# EAGLE schematic MainBoard (EAGLE 9.6.2)
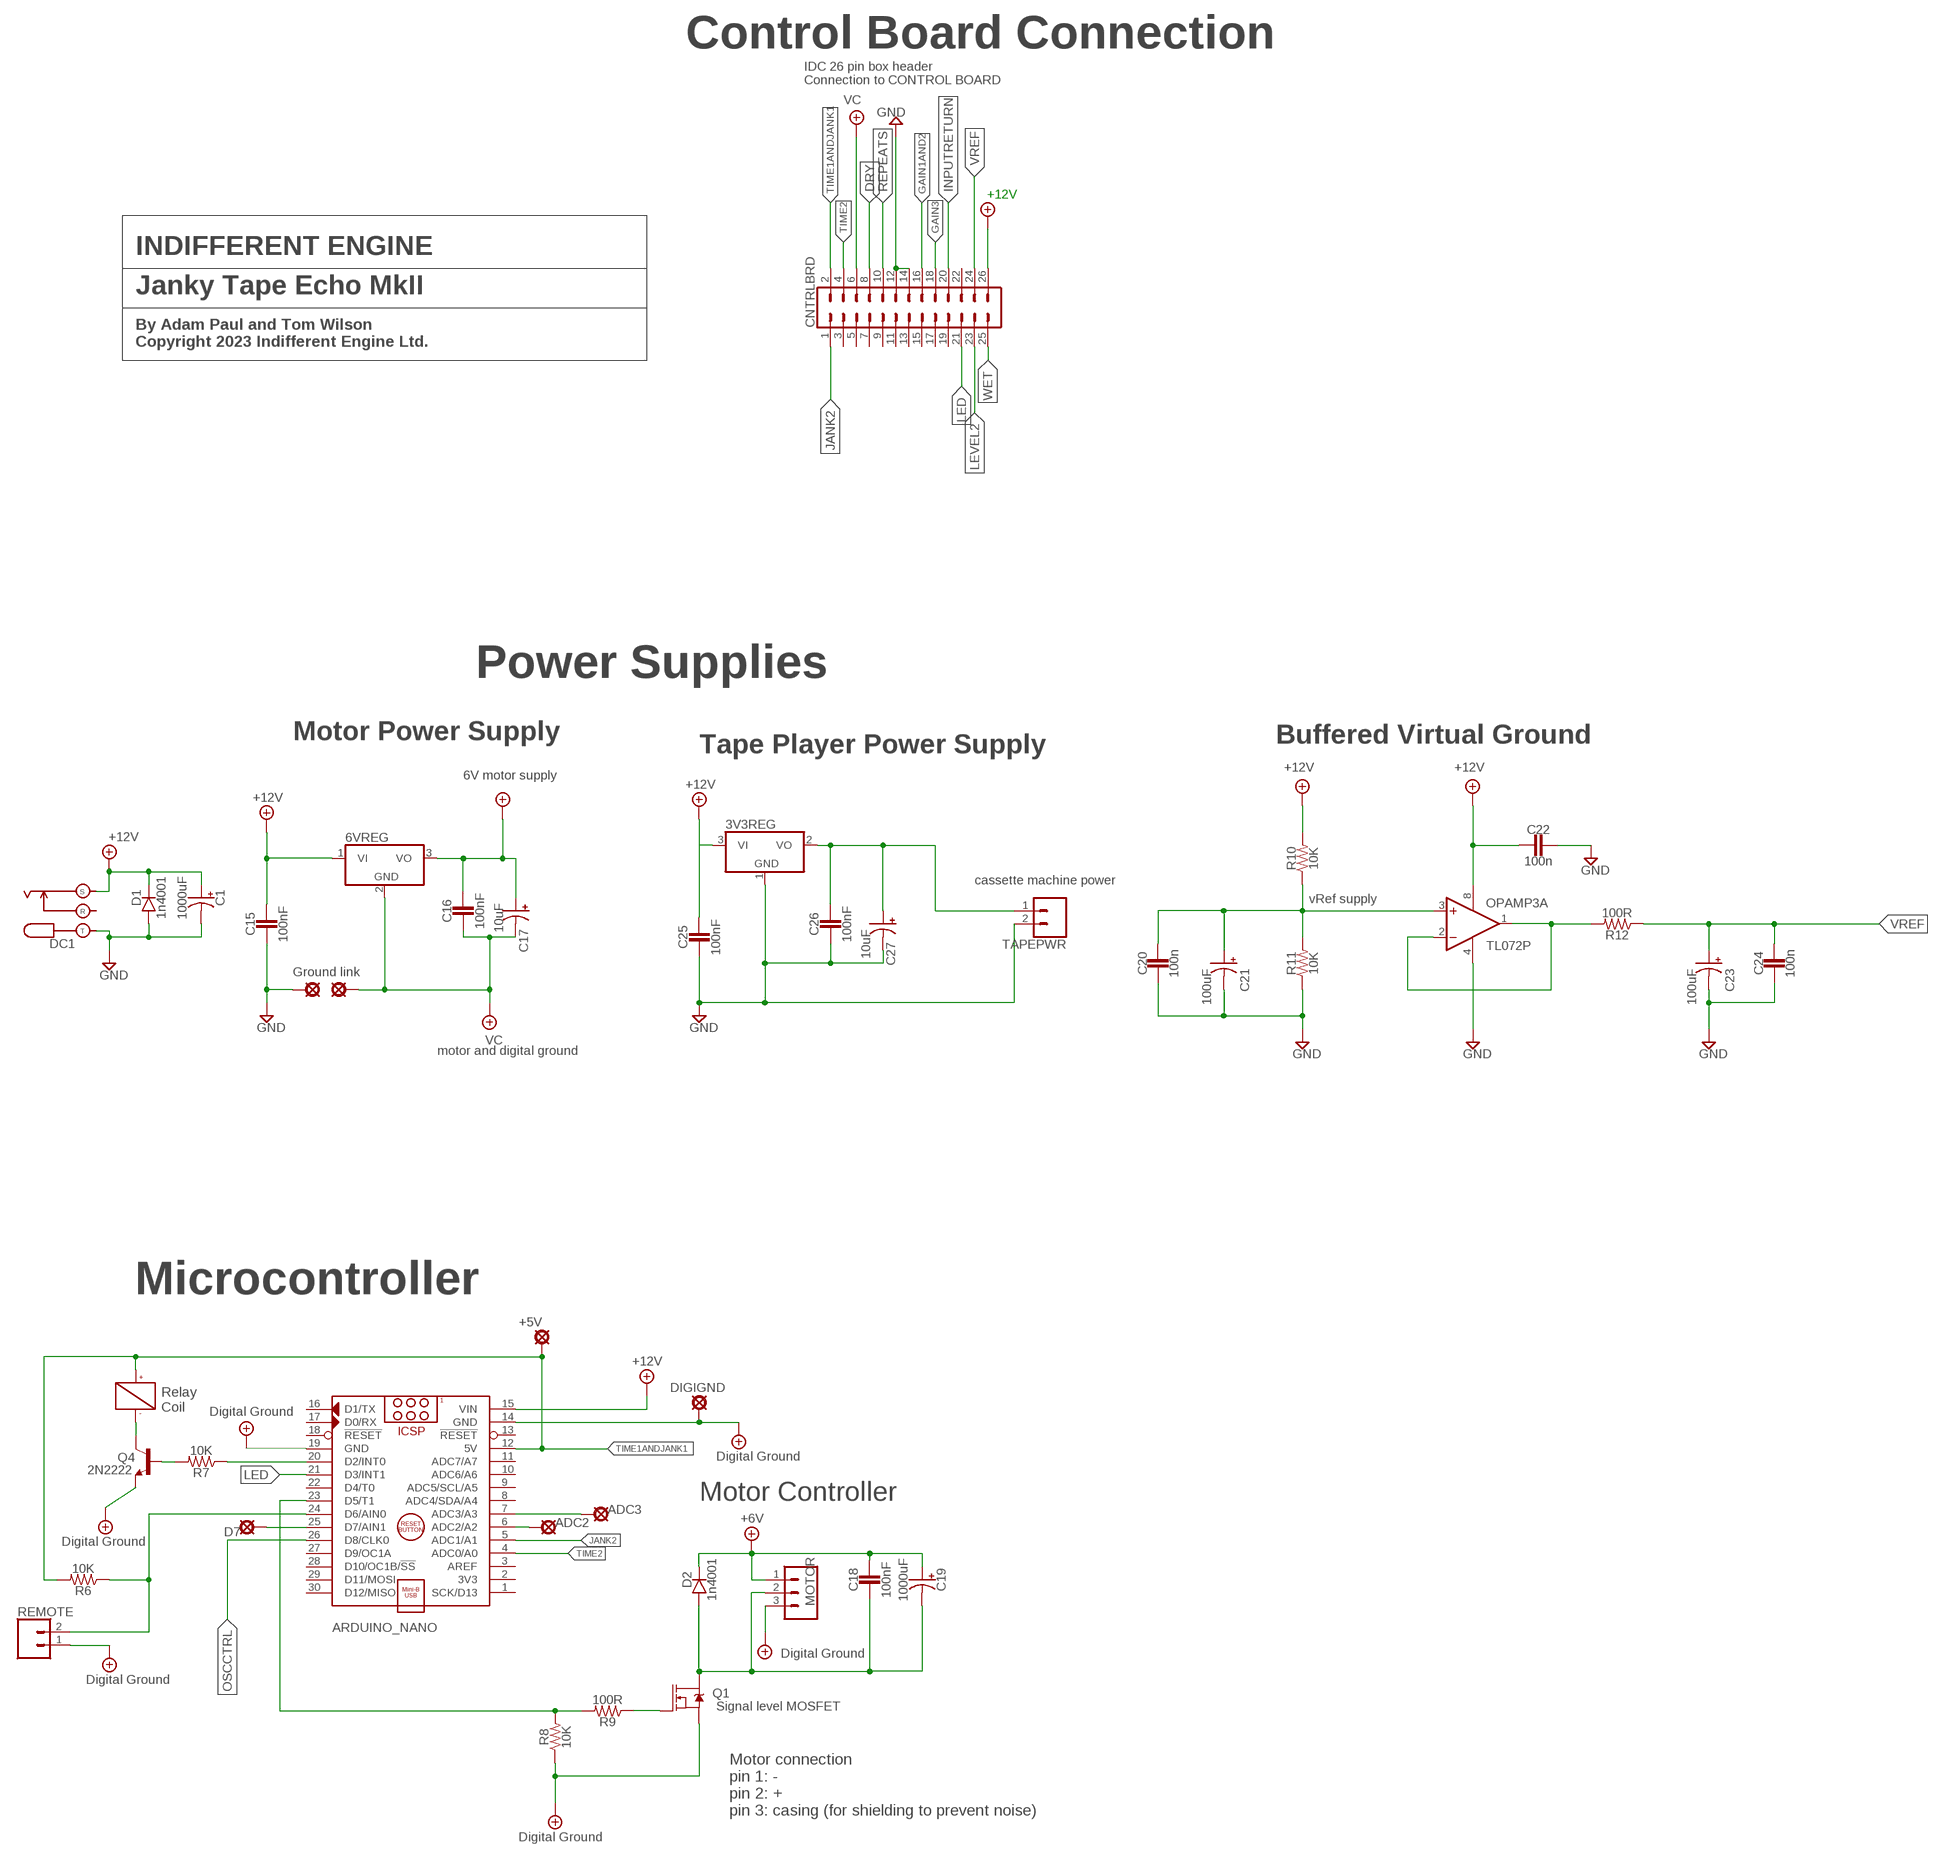
[diagram p0: schematic, sheet 1, part 1 of 2]
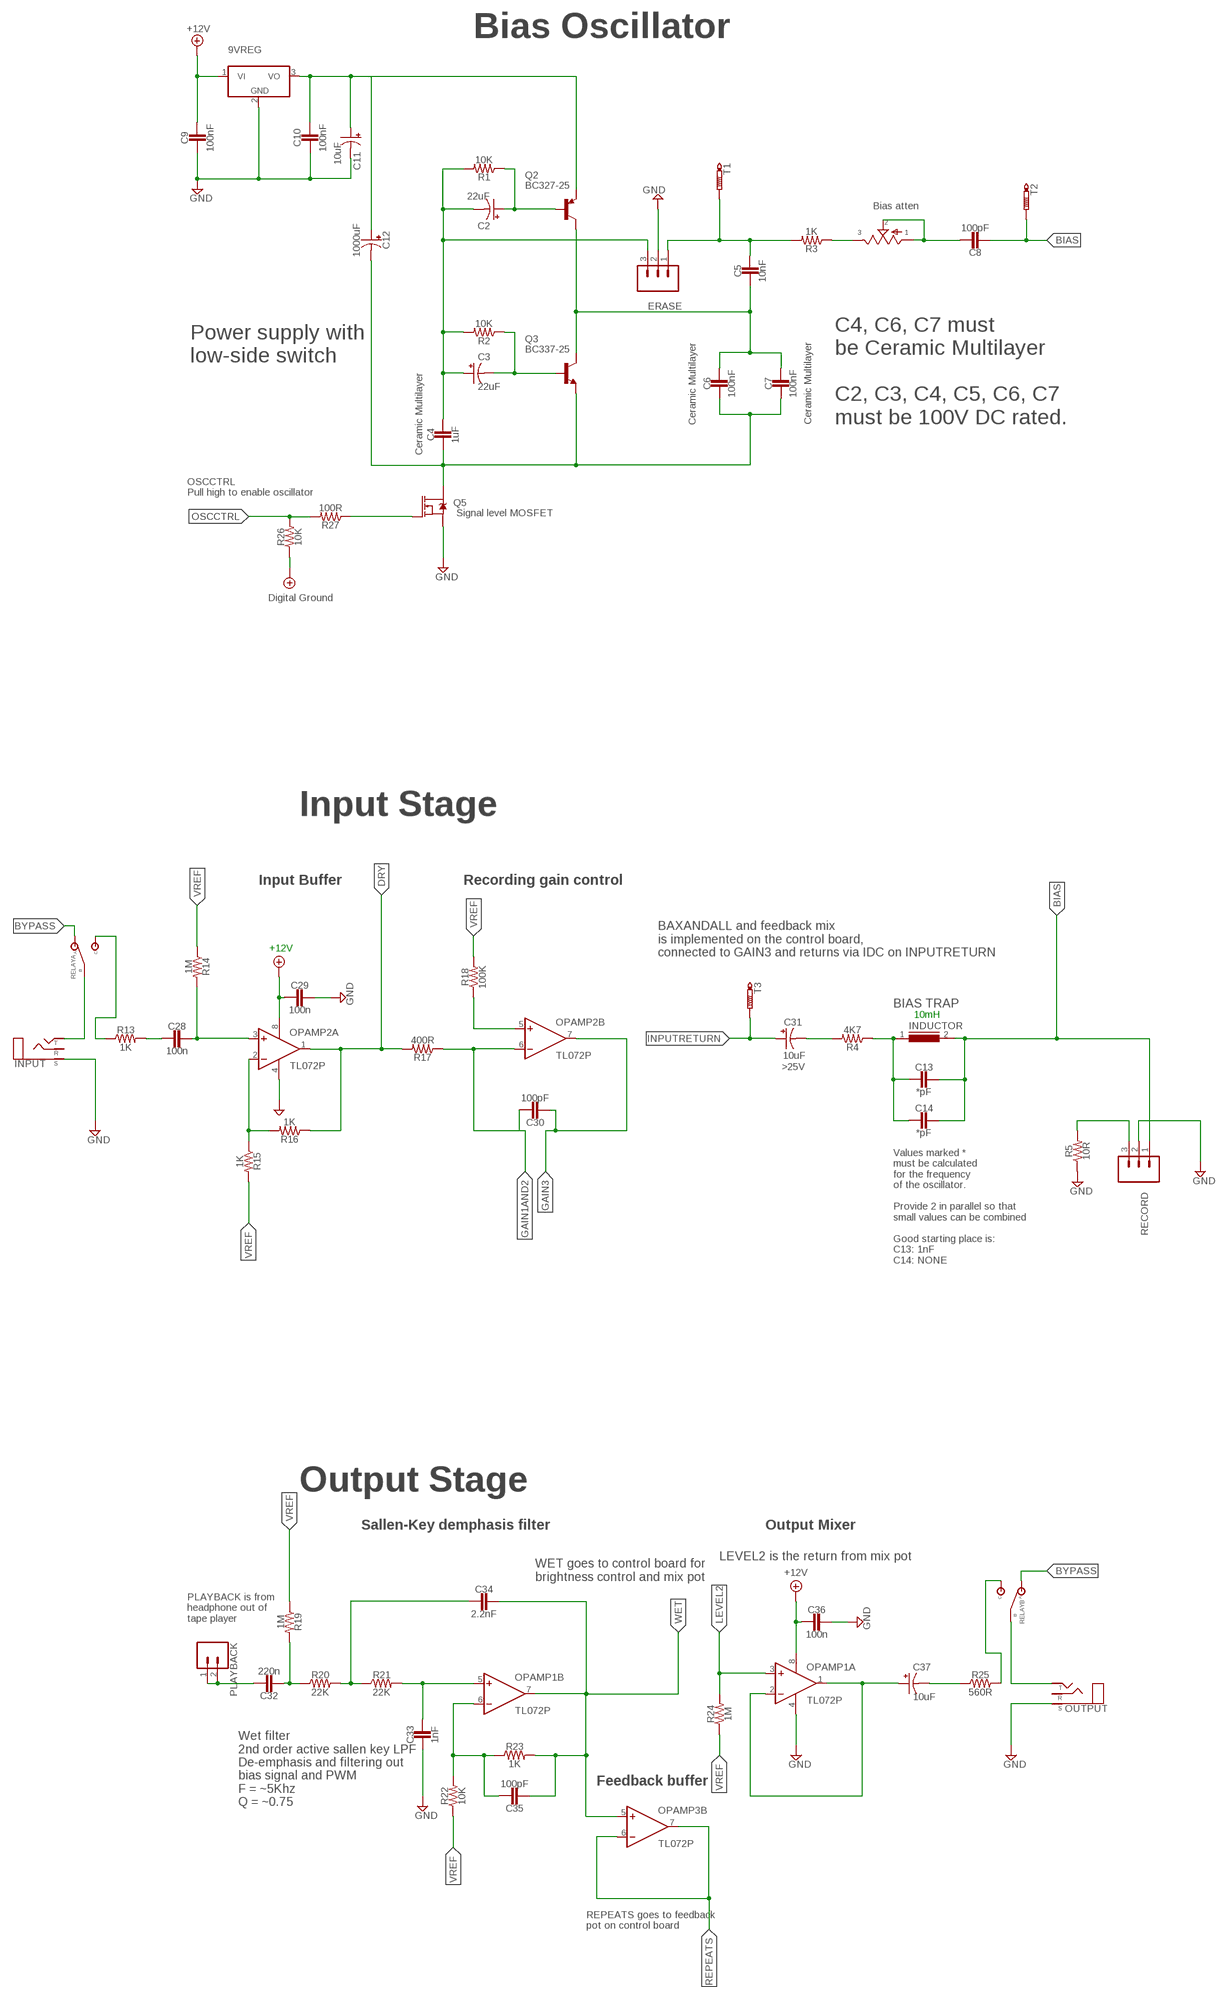
[diagram p1: schematic, sheet 1, part 2 of 2]

## Parts
3V3REG  78TO220H_2_SMALL  [TO220H_SMALL]
6VREG  78TO220H_SMALL  [TO220H_SMALL]
9VREG  78TO220H_SMALL  [TO220H_SMALL]
+5V  PADL  [LONG]
ADC2  PADL  [LONG]
ADC3  PADL  [LONG]
ANALOG_GND  PADL  [LONG]
ARDUINO_NANO  ARDUINO_NANO  [ARDUINO_NANO]
BIASLEVEL  POTTRIM3/8  [B375P]
C1  1000uF  8.0_MM.2  [080_5MM]
C2  22uF  5.0_MM.3  [050_2.5MM.1]
C3  22uF  5.0_MM.3  [050_2.5MM.1]
C4  1uF  CAP.2  [5MM]
C5  10nF  CAP.2  [5MM]
C6  100nF  CAP.2  [5MM]
C7  100nF  CAP.2  [5MM]
C8  100pF  CAP.5  [.33UF+]
C9  100nF  CAP.2  [5MM]
C10  100nF  CAP.2  [5MM]
C11  10uF  5.0_MM.3  [050_2.5MM.1]
C12  1000uF  8.0_MM.2  [080_5MM]
C13  *pF  CAP.5  [.33UF+]
C14  *pF  CAP.5  [.33UF+]
C15  100nF  CAP.2  [5MM]
C16  100nF  CAP.2  [5MM]
C17  10uF  5.0_MM.3  [050_2.5MM.1]
C18  100nF  CAP.5  [.33UF+]
C19  1000uF  8.0_MM.2  [080_5MM]
C20  100n  CAP.2  [5MM]
C21  100uF  5.0_MM.3  [050_2.5MM.1]
C22  100n  CAP.2  [5MM]
C23  100uF  5.0_MM.3  [050_2.5MM.1]
C24  100n  CAP.2  [5MM]
C25  100nF  CAP.2  [5MM]
C26  100nF  CAP.2  [5MM]
C27  10uF  5.0_MM.3  [050_2.5MM.1]
C28  100n  CAP.5  [.33UF+]
C29  100n  CAP.2  [5MM]
C30  100pF  CAP.5  [.33UF+]
C31  10uF  5.0_MM.3  [050_2.5MM.1]
C32  220n  CAP.5  [.33UF+]
C33  1nF  CAP.5  [.33UF+]
C34  2.2nF  CAP.5  [.33UF+]
C35  100pF  CAP.5  [.33UF+]
C36  100n  CAP.2  [5MM]
C37  10uF  5.0_MM.3  [050_2.5MM.1]
CNTRLBRD  CONN_13X22X13  [2X13]
D1  1n4001  DO41.3  [DO41-3]
D2  1n4001  DO41.3  [DO41-3]
D7  PADL  [LONG]
DC1  DC_KOBICONN  [DC_KOBICONN]
DIGI_GROUND  PADL  [LONG]
DIGIGND  PADL  [LONG]
ERASE  455-1750-1-ND  CONN_03  [1X03]
INDUCTOR  82114R  [82114R]
INPUT  STEREO  [STEREO_PCB]
MOTOR  455-1750-1-ND  CONN_03  [1X03]
OPAMP1  TL072P  [DIL08]
OPAMP2  TL072P  [DIL08]
OPAMP3  TL072P  [DIL08]
OUTPUT  STEREO  [STEREO_PCB]
PLAYBACK  CONN_02  [1X02]
Q1  60V/32A/35mΩ  MOSFET-NCH-FQP30N06L  [TO220V]
Q2  BC327-25  [TO92-EBC]
Q3  BC337-25TO92  [TO92-EBC]
Q4  2N2222  [TO92-]
Q5  60V/32A/35mΩ  MOSFET-NCH-FQP30N06L  [TO220V]
R1  10K  R.3B  [7.5MM.2]
R2  10K  R.3B  [7.5MM.2]
R3  1K  R.3B  [7.5MM.2]
R4  4K7  R.3B  [7.5MM.2]
R5  10R  R.3B  [7.5MM.2]
R6  10K  R.3B  [7.5MM.2]
R7  10K  R.3B  [7.5MM.2]
R8  10K  R.3B  [7.5MM.2]
R9  100R  R.3B  [7.5MM.2]
R10  10K  R.3B  [7.5MM.2]
R11  10K  R.3B  [7.5MM.2]
R12  100R  R.3B  [7.5MM.2]
R13  1K  R.3B  [7.5MM.2]
R14  1M  R.3B  [7.5MM.2]
R15  1K  R.3B  [7.5MM.2]
R16  1K  R.3B  [7.5MM.2]
R17  400R  R.3B  [7.5MM.2]
R18  100K  R.3B  [7.5MM.2]
R19  1M  R.3B  [7.5MM.2]
R20  22K  R.3B  [7.5MM.2]
R21  22K  R.3B  [7.5MM.2]
R22  10K  R.3B  [7.5MM.2]
R23  1K  R.3B  [7.5MM.2]
R24  1M  R.3B  [7.5MM.2]
R25  560R  R.3B  [7.5MM.2]
R26  10K  R.3B  [7.5MM.2]
R27  100R  R.3B  [7.5MM.2]
RECORD  455-1750-1-ND  CONN_03  [1X03]
RELAY  IM02TSIM02TS  [8-PIN]
REMOTE  CONN_02  [1X02]
T1  PTR1B2,54  [B2,54]
T2  PTR1B2,54  [B2,54]
T3  PTR1B2,54  [B2,54]
TAPEPWR  CONN_02  [1X02]

## Nets
+12V: 3V3REG.3(VI) 6VREG.1(VI) 9VREG.1(VI) ARDUINO_NANO.15(VIN) C1.+ C9.1 C15.1 C22.2 C25.1 C29.2 C36.2 CNTRLBRD.26 D1.C DC1.S OPAMP1.8(P:V+) OPAMP2.8(P:V+) OPAMP3.8(P:V+) R10.2 ; supply symbol labelled +9V
BIAS: C8.2 C13.1 C14.1 INDUCTOR.2 RECORD.1 T2.TP
BYPASS: RELAY.3(A:A) RELAY.10(B:A)
DRY: CNTRLBRD.8 OPAMP2.1(A:OUT) R16.1 R17.2
GAIN1AND2: C30.1 CNTRLBRD.16 OPAMP2.6(B:-IN) R17.1
GAIN3: C30.2 CNTRLBRD.18 OPAMP2.7(B:OUT)
GND: 3V3REG.1(GND) 9VREG.2(GND) ANALOG_GND.1(PAD) C1.- C9.2 C10.2 C11.- C15.2 C20.2 C21.- C22.1 C23.- C24.2 C25.2 C26.2 C27.- C29.1 C33.2 C36.1 CNTRLBRD.12 CNTRLBRD.14 D1.A DC1.T ERASE.2 INPUT.P$1(S) OPAMP1.4(P:V-) OPAMP2.4(P:V-) OPAMP3.4(P:V-) OUTPUT.P$1(S) Q5.3(S) R5.1 R11.1 RECORD.2 TAPEPWR.2
INPUTRETURN: C31.+ CNTRLBRD.20 T3.TP
JANK2: ARDUINO_NANO.5(ADC1/A1) CNTRLBRD.1
LED: ARDUINO_NANO.21(D3/INT1) CNTRLBRD.21
LEVEL2: CNTRLBRD.23 OPAMP1.3(A:+IN) R24.2
N$1: INPUT.P$3(T) RELAY.4(A:B)
N$2: ARDUINO_NANO.23(D5/T1) R8.2 R9.2
N$3: C18.2 C19.- D2.A MOTOR.2 Q1.2(D)
N$4: Q1.1(G) R9.1
N$5: C28.2 R13.2
N$6: OPAMP2.5(B:+IN) R18.1
N$7: OPAMP2.2(A:-IN) R15.1 R16.2
N$8: C13.2 C14.2 INDUCTOR.1 R4.1
N$9: Q5.1(G) R27.1
N$10: R5.2 RECORD.3
N$12: R13.1 RELAY.5(A:C)
N$13: C33.1 OPAMP1.5(B:+IN) R21.2
N$14: C32.2 R19.2 R20.1
N$15: C35.1 OPAMP1.6(B:-IN) R22.2 R23.1
N$16: C20.1 C21.+ OPAMP3.3(A:+IN) R10.1 R11.2
N$17: C34.2 R20.2 R21.1
N$18: C28.1 OPAMP2.3(A:+IN) R14.2
N$19: C37.+ OPAMP1.1(A:OUT) OPAMP1.2(A:-IN)
N$20: C37.- R25.1
N$21: R25.2 RELAY.8(B:C)
N$22: C2.+ Q2.B R1.1
N$23: C3.- Q3.B R2.1
N$24: C2.- C3.+ C4.1 ERASE.3 R1.2 R2.2
N$25: C5.2 C6.1 C7.1 Q2.C Q3.C
N$26: C5.1 ERASE.1 R3.2 T1.TP
N$27: BIASLEVEL.3 R3.1
N$28: OUTPUT.P$3(T) RELAY.9(B:B)
N$29: Q4.2(B) R7.2
N$30: BIASLEVEL.1 BIASLEVEL.2 C8.1
N$31: C31.- R4.2
N$32: ARDUINO_NANO.20(D2/INT0) R7.1
N$33: Q4.1(C) RELAY.1(C:-)
N$34: ARDUINO_NANO.24(D6/AIN0) R6.1 REMOTE.2
N$35: OPAMP3.1(A:OUT) OPAMP3.2(A:-IN) R12.2
N$36: 9VREG.3(VO) C10.1 C11.+ C12.+ Q2.E
N$37: 3V3REG.2(VO) C26.1 C27.+ TAPEPWR.1
N$38: C4.2 C6.2 C7.2 C12.- Q3.E Q5.2(D)
N$45: ADC2.1(PAD) ARDUINO_NANO.6(ADC2/A2)
N$46: ADC3.1(PAD) ARDUINO_NANO.7(ADC3/A3)
N$48: ARDUINO_NANO.25(D7/AIN1) D7.1(PAD)
OSCCTRL: ARDUINO_NANO.26(D8/CLK0) R26.2 R27.2
PLAYBACK: C32.1 PLAYBACK.1 PLAYBACK.2
REPEATS: CNTRLBRD.10 OPAMP3.6(B:-IN) OPAMP3.7(B:OUT)
TIME1ANDJANK1: +5V.1(PAD) ARDUINO_NANO.12(5V) CNTRLBRD.2 R6.2 RELAY.12(C:+)
TIME2: ARDUINO_NANO.4(ADC0/A0) CNTRLBRD.4
VC: 6VREG.2(GND) ARDUINO_NANO.14(GND) ARDUINO_NANO.19(GND) C16.2 C17.- CNTRLBRD.6 DIGI_GROUND.1(PAD) DIGIGND.1(PAD) MOTOR.3 Q1.3(S) Q4.3(E) R8.1 R26.1 REMOTE.1
VD: 6VREG.3(VO) C16.1 C17.+ C18.1 C19.+ D2.C MOTOR.1
VREF: C23.+ C24.1 CNTRLBRD.24 R12.1 R14.1 R15.2 R18.2 R19.1 R22.1 R24.1
WET: C34.1 C35.2 CNTRLBRD.25 OPAMP1.7(B:OUT) OPAMP3.5(B:+IN) R23.2
Unconnected: ARDUINO_NANO.1(SCK/D13) ARDUINO_NANO.2(3V3) ARDUINO_NANO.3(AREF) ARDUINO_NANO.8(ADC4/SDA/A4) ARDUINO_NANO.9(ADC5/SCL/A5) ARDUINO_NANO.10(ADC6/A6) ARDUINO_NANO.11(ADC7/A7) ARDUINO_NANO.13(!RESET) ARDUINO_NANO.16(D1/TX) ARDUINO_NANO.17(D0/RX) ARDUINO_NANO.18(!RESET) ARDUINO_NANO.22(D4/T0) ARDUINO_NANO.27(D9/OC1A) ARDUINO_NANO.28(D10/OC1B/!SS) ARDUINO_NANO.29(D11/MOSI) ARDUINO_NANO.30(D12/MISO) CNTRLBRD.3 CNTRLBRD.5 CNTRLBRD.7 CNTRLBRD.9 CNTRLBRD.11 CNTRLBRD.13 CNTRLBRD.15 CNTRLBRD.17 CNTRLBRD.19 CNTRLBRD.22 DC1.R INPUT.P$2(R) OUTPUT.P$2(R)

## Notes on the sheet
- Control Board Connection
- IDC 26 pin box header
  Connection to CONTROL BOARD
- +12V
- INDIFFERENT ENGINE
- Janky Tape Echo MkII
- By Adam Paul and Tom Wilson
  Copyright 2023 Indifferent Engine Ltd.
- Power Supplies
- Motor Power Supply | Buffered Virtual Ground
- Tape Player Power Supply
- 6V motor supply
- +12V
- +12V
- +12V
- cassette machine power
- vRef supply
- Ground link
- motor and digital ground
- Microcontroller
- +12V
- Relay
  Coil
- Digital Ground
- Digital Ground
- Motor Controller
- +6V
- Digital Ground
- Digital Ground
- Digital Ground
- Signal level MOSFET
- Motor connection
  pin 1: -
  pin 2: +
  pin 3: casing (for shielding to prevent noise)
- Digital Ground
- +12V
- Bias Oscillator
- Bias atten
- Ceramic Multilayer
- BC337-25
- Power supply with
  low-side switch
- C4, C6, C7 must
  be Ceramic Multilayer
  
  C2, C3, C4, C5, C6, C7 
  must be 100V DC rated.
- Ceramic Multilayer
- Ceramic Multilayer
- OSCCTRL
  Pull high to enable oscillator
- Signal level MOSFET
- Digital Ground
- Input Stage
- Input Buffer | Recording gain control
- +12V
- BAXANDALL and feedback mix
  is implemented on the control board, 
  connected to GAIN3 and returns via IDC on INPUTRETURN
- BIAS TRAP
- 10mH
- Values marked * 
  must be calculated 
  for the frequency 
  of the oscillator.
  
  Provide 2 in parallel so that
  small values can be combined
  
  Good starting place is:
  C13: 1nF
  C14: NONE
- Output Stage
- Sallen-Key demphasis filter | Output Mixer
- LEVEL2 is the return from mix pot
- +12V
- WET goes to control board for
  brightness control and mix pot
- PLAYBACK is from
  headphone out of
  tape player
- Feedback buffer
- Wet filter
  2nd order active sallen key LPF
  De-emphasis and filtering out 
  bias signal and PWM
  F = ~5Khz
  Q = ~0.75
- REPEATS goes to feedback
  pot on control board

## Library data of the parts
3V3REG 6VREG 9VREG = AdamsStuff:78*: Positive VOLTAGE REGULATOR Source: http://cache.national.com/ds/LM/LM78L05.pdf http://www.fairchildsemi.com/ds/LM/LM7805.pdf
+5V ADC2 ADC3 ANALOG_GND D7 DIGI_GROUND DIGIGND = gm-supply:PAD: PAD use this package for pads with any purpose, including input, output, send or return various pad shapes: round, square, octogonal, long, and long offset
ARDUINO_NANO = ArduinoNanoV30:ARDUINO_NANO: Arduino Nano V3.0 Module Overview: The Arduino Nano is a small, complete, and breadboard-friendly board based on the ATmega328 (Arduino Nano 3.x) or ATmega168 (Arduino Nano 2.x). It has more or less the same functionality of the Arduino Duemilanove, but in a different package. It lacks only a DC power jack, and works with a Mini-B USB cable instead of a standard one. The Nano was designed and is being produced by Gravitech <http://www.gravitech.us/arna30wiatp.html>. General specifications: Item Value Microcontroller Atmel ATmega168 or ATmega328 Operating Voltage (logic level) 5 V Input Voltage (recommended) 7-12 V Input Voltage (limits) 6-20 V Digital I/O Pins 14 (of which 6 provide PWM output) Analog Input Pins 8 DC Current per I/O Pin 40 mA Flash Memory 16 KB (ATmega168) or 32 KB (ATmega328) of which 2 KB used by bootloader SRAM 1 KB (ATmega168) or 2 KB (ATmega328) EEPROM 512 bytes (ATmega168) or 1 KB (ATmega328) Clock Speed 16 MHz Dimensions (Inches) 0.73" x 1.70" Dimensions (mm) 18mm x 45mm Overall height About 9 mm (not including pins) Weigth 5 g Power: The Arduino Nano can be powered via the Mini-B USB connection, 6-20V unregulated external power supply (pin 30), or 5V regulated external power supply (pin 27). The power source is automatically selected to the highest voltage source. Memory: The ATmega168 has 16 KB of flash memory for storing code (of which 2 KB is used for the bootloader); the ATmega328 has 32 KB, (also with 2 KB used for the bootloader). The ATmega168 has 1 KB of SRAM and 512 bytes of EEPROM (which can be read and written with the EEPROM library); the ATmega328 has 2 KB of SRAM and 1 KB of EEPROM. Input and Output: Each of the 14 digital pins on the Nano can be used as an input or output, using pinMode(), digitalWrite(), and digitalRead() functions. They operate at 5 volts. Each pin can provide or receive a maximum of 40 mA and has an internal pull-up resistor (disconnected by default) of 20-50 kOhms. In addition, some pins have specialized functions. Visit Arduino - ArduinoBoardNano <https://www.arduino.cc/en/Main/ArduinoBoardNano>
BIASLEVEL = gm-pots:POT: Potentiometers the arrow indicates the clockwise motion of th wiper (lug 2) fully counter clockwise there is no resistance between lugs 1 and 2 fully clockwise the resistance between lugs 1 and 2 is the value of the pot
C1 C12 C19 = capacitors-elec:8.0_MM: 8mm Diameter
C2 C3 C11 C17 C21 C23 C27 C37 = capacitors-elec:5.0_MM: 5mm Diameter
C4-C10 C13-C16 C18 C20 C22 C24-C26 C28-C30 C32-C36 = capacitors-film:CAP: For Ceramic, Film, MLCC caps
C31 = capacitors-elec:5.0_MM: 5mm Diameter; VOLTAGE: >25V
CNTRLBRD = SparkFun-Connectors:CONN_13X2: Multi connection point. Often used as Generic Header-pin footprint for 0.1 inch spaced/style header connections On any of the 0.1 inch spaced packages, you can populate with these: Break Away Headers - Straight <https://www.sparkfun.com/products/116> (PRT-00116) Break Away Male Headers - Right Angle <https://www.sparkfun.com/products/553> (PRT-00553) Female Headers <https://www.sparkfun.com/products/115> (PRT-00115) Break Away Headers - Machine Pin <https://www.sparkfun.com/products/117> (PRT-00117) Break Away Female Headers - Swiss Machine Pin <https://www.sparkfun.com/products/743> (PRT-00743)
D1 D2 = diodes:DO41: DO-41 Package Diodes: 1N4001 - 1N40019 Zener Diodes: 1N4728 - 1N4764
DC1 = jacks:DC_KOBICONN
ERASE MOTOR RECORD = SparkFun-Connectors:CONN_03: Multi connection point. Often used as Generic Header-pin footprint for 0.1 inch spaced/style header connections On any of the 0.1 inch spaced packages, you can populate with these: Break Away Headers - Straight <https://www.sparkfun.com/products/116> (PRT-00116) Break Away Male Headers - Right Angle <https://www.sparkfun.com/products/553> (PRT-00553) Female Headers <https://www.sparkfun.com/products/115> (PRT-00115) Break Away Headers - Machine Pin <https://www.sparkfun.com/products/117> (PRT-00117) Break Away Female Headers - Swiss Machine Pin <https://www.sparkfun.com/products/743> (PRT-00743) Stackable Header - 3 Pin (Female, 0.1") <https://www.sparkfun.com/products/13875> (PRT-13875) For SCREWTERMINALS and SPRING TERMINALS visit here: Screw Terimnals on SparkFun.com <https://www.sparkfun.com/search/results?term=Screw+Terminals> (5mm/3.5mm/2.54mm spacing) This device is also useful as a general connection point to wire up your design to another part of your project. Our various solder wires solder well into these plated through hole pads. Hook-Up Wire - Assortment (Stranded, 22 AWG) <https://www.sparkfun.com/products/11375> (PRT-11375) Hook-Up Wire - Assortment (Solid Core, 22 AWG) <https://www.sparkfun.com/products/11367> (PRT-11367) View the entire wire category on our website here <https://www.sparkfun.com/categories/141> Special notes: Molex polarized connector foot print use with SKU : PRT-08232 with associated crimp pins and housings.; PROD_ID: XXX-00000
INDUCTOR = inductors:82114R: INDUCTOR; SPICEPREFIX: L
INPUT OUTPUT = jacks:STEREO
OPAMP1-OPAMP3 = AdamsStuff:TL072: OP AMP
PLAYBACK REMOTE TAPEPWR = SparkFun-Connectors:CONN_02: Multi connection point. Often used as Generic Header-pin footprint for 0.1 inch spaced/style header connections On any of the 0.1 inch spaced packages, you can populate with these: Break Away Headers - Straight <https://www.sparkfun.com/products/116> (PRT-00116) Break Away Male Headers - Right Angle <https://www.sparkfun.com/products/553> (PRT-00553) Female Headers <https://www.sparkfun.com/products/115> (PRT-00115) Break Away Headers - Machine Pin <https://www.sparkfun.com/products/117> (PRT-00117) Break Away Female Headers - Swiss Machine Pin <https://www.sparkfun.com/products/743> (PRT-00743) For SCREWTERMINALS and SPRING TERMINALS visit here: Screw Terimnals on SparkFun.com <https://www.sparkfun.com/search/results?term=Screw+Terminals> (5mm/3.5mm/2.54mm spacing) This device is also useful as a general connection point to wire up your design to another part of your project. Our various solder wires solder well into these plated through hole pads. Hook-Up Wire - Assortment (Stranded, 22 AWG) <https://www.sparkfun.com/products/11375> (PRT-11375) Hook-Up Wire - Assortment (Solid Core, 22 AWG) <https://www.sparkfun.com/products/11367> (PRT-11367) View the entire wire category on our website here <https://www.sparkfun.com/categories/141> Special notes: Molex polarized connector foot print use with: PRT-08233 with associated crimp pins and housings. 2.54_SCREWTERM for use with PRT-10571. 3.5mm Screw Terminal footprints for PRT-08084 5mm Screw Terminal footprints for use with PRT-08432
Q1 Q5 = SparkFun-DiscreteSemi:MOSFET-NCH: N-channel MOSFETs Voltage controlled devices that allow control of high current outputs. SparkFun Products: SparkFun OpenScale <https://www.sparkfun.com/products/13261> SparkFun Digital Sandbox <https://www.sparkfun.com/products/12651> SparkFun Monster Moto Shield <https://www.sparkfun.com/products/10182> SparkFun MOSFET Power Controller <https://www.sparkfun.com/products/11214>; PROD_ID: TRANS-10060
Q2 = AdamsStuff:BC327*: PNP Transistror
Q3 = AdamsStuff:BC337*: NPN Transistor
Q4 = AdamsStuff:2N2222: NPN Transistor
R1-R27 = resistors:R: 1/8W, 1/4W and 1W resistors
RELAY = AdamsStuff:IM02TS
T1-T3 = testpad:PTR1: TEST PIN